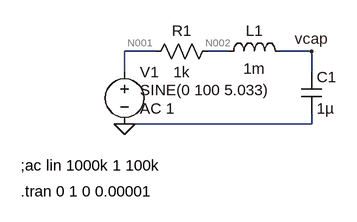
[diagram p0: schematic RLC_series.asc]
RLC_series.asc, the LTspice schematic file:
Version 4
SHEET 1 880 680
WIRE 112 112 64 112
WIRE 224 112 192 112
WIRE 352 112 304 112
WIRE 64 144 64 112
WIRE 352 144 352 112
WIRE 352 224 352 208
WIRE 352 224 64 224
FLAG 64 224 0
FLAG 352 112 vcap
SYMBOL ind 208 128 R270
WINDOW 0 32 56 VTop 2
WINDOW 3 5 56 VBottom 2
SYMATTR InstName L1
SYMATTR Value 1m
SYMBOL cap 336 144 R0
SYMATTR InstName C1
SYMATTR Value 1µ
SYMBOL voltage 64 128 R0
WINDOW 123 24 72 Left 2
WINDOW 39 0 0 Left 2
WINDOW 3 24 44 Left 2
SYMATTR Value2 AC 1
SYMATTR Value SINE(0 100 5.033)
SYMATTR InstName V1
SYMBOL res 96 128 R270
WINDOW 0 32 56 VTop 2
WINDOW 3 0 56 VBottom 2
SYMATTR InstName R1
SYMATTR Value 1k
TEXT -96 328 Left 2 !.tran 0 1 0 0.00001
TEXT -96 288 Left 2 !;ac lin 1000k 1 100k

The netlist it stands for:
* RLC_series.asc
L1 N002 vcap 1m
C1 vcap 0 1µ
V1 N001 0 SINE(0 100 5.033) AC 1
R1 N001 N002 1k
.tran 0 1 0 0.00001
;ac lin 1000k 1 100k
.backanno
.end

* Results of the author's LTspice run, read from the files saved beside the schematic
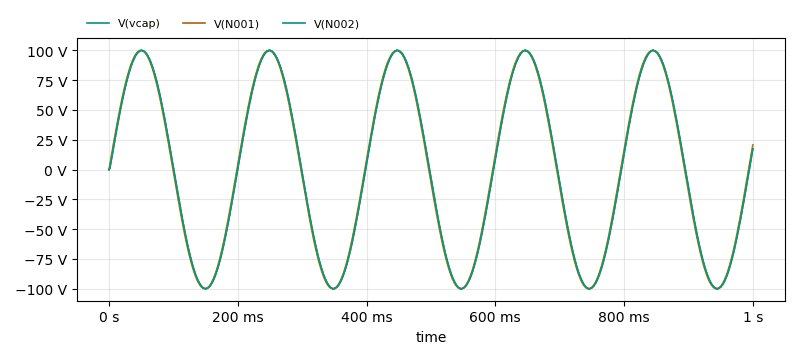
[diagram p1: Transient Analysis of RLC_series.asc, plotted from the saved traces]
* Transient Analysis, 1 run:
*   V(vcap): min -99.95 V, max 99.95 V, average 50.27 mV, rms 70.45 V, last 17.47 V
*   V(N001): min -100 V, max 100 V, average 67.7 mV, rms 70.48 V, last 20.59 V
*   V(N002): min -99.95 V, max 99.95 V, average 50.28 mV, rms 70.45 V, last 17.47 V